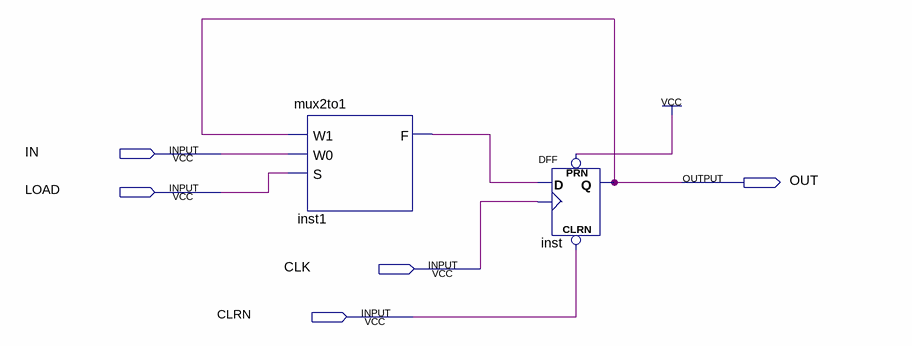
[diagram p0: schematic sheet]
// Quartus schematic register.bdf as structural Verilog: 2 symbols, 5 pins
module register (
  input  IN,
  input  LOAD,
  input  CLK,
  input  CLRN,
  output OUT
);

  wire inst1_f;

  mux2to1 inst1 (.W1(OUT), .W0(IN), .S(LOAD), .F(inst1_f));
  DFF inst (.CLRN(CLRN), .CLK(CLK), .D(inst1_f), .PRN(1'b1), .Q(OUT));
endmodule
